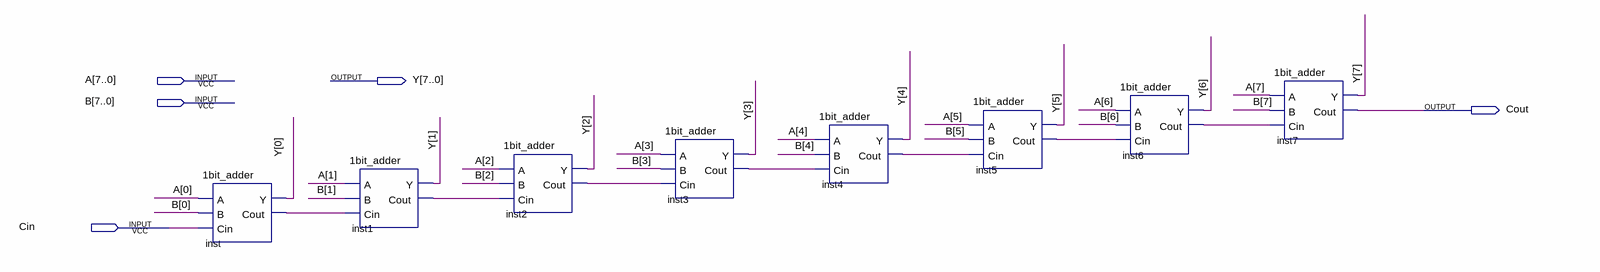
[diagram p0: schematic sheet]
// Quartus schematic 8bit_adder.bdf as structural Verilog: 8 symbols, 5 pins
module \8bit_adder  (
  input  [7:0] A,
  input  [7:0] B,
  input  Cin,
  output [7:0] Y,
  output Cout
);

  wire inst1_cout, inst2_cout, inst3_cout, inst4_cout, inst5_cout, inst6_cout, inst_cout;

  \1bit_adder  inst (.A(A[0]), .B(B[0]), .Cin(Cin), .Y(Y[0]), .Cout(inst_cout));
  \1bit_adder  inst1 (.A(A[1]), .B(B[1]), .Cin(inst_cout), .Y(Y[1]), .Cout(inst1_cout));
  \1bit_adder  inst2 (.A(A[2]), .B(B[2]), .Cin(inst1_cout), .Y(Y[2]), .Cout(inst2_cout));
  \1bit_adder  inst3 (.A(A[3]), .B(B[3]), .Cin(inst2_cout), .Y(Y[3]), .Cout(inst3_cout));
  \1bit_adder  inst4 (.A(A[4]), .B(B[4]), .Cin(inst3_cout), .Y(Y[4]), .Cout(inst4_cout));
  \1bit_adder  inst5 (.A(A[5]), .B(B[5]), .Cin(inst4_cout), .Y(Y[5]), .Cout(inst5_cout));
  \1bit_adder  inst6 (.A(A[6]), .B(B[6]), .Cin(inst5_cout), .Y(Y[6]), .Cout(inst6_cout));
  \1bit_adder  inst7 (.A(A[7]), .B(B[7]), .Cin(inst6_cout), .Y(Y[7]), .Cout(Cout));
endmodule
